# EAGLE design TouringMachineA2 (EAGLE 9.6.2)
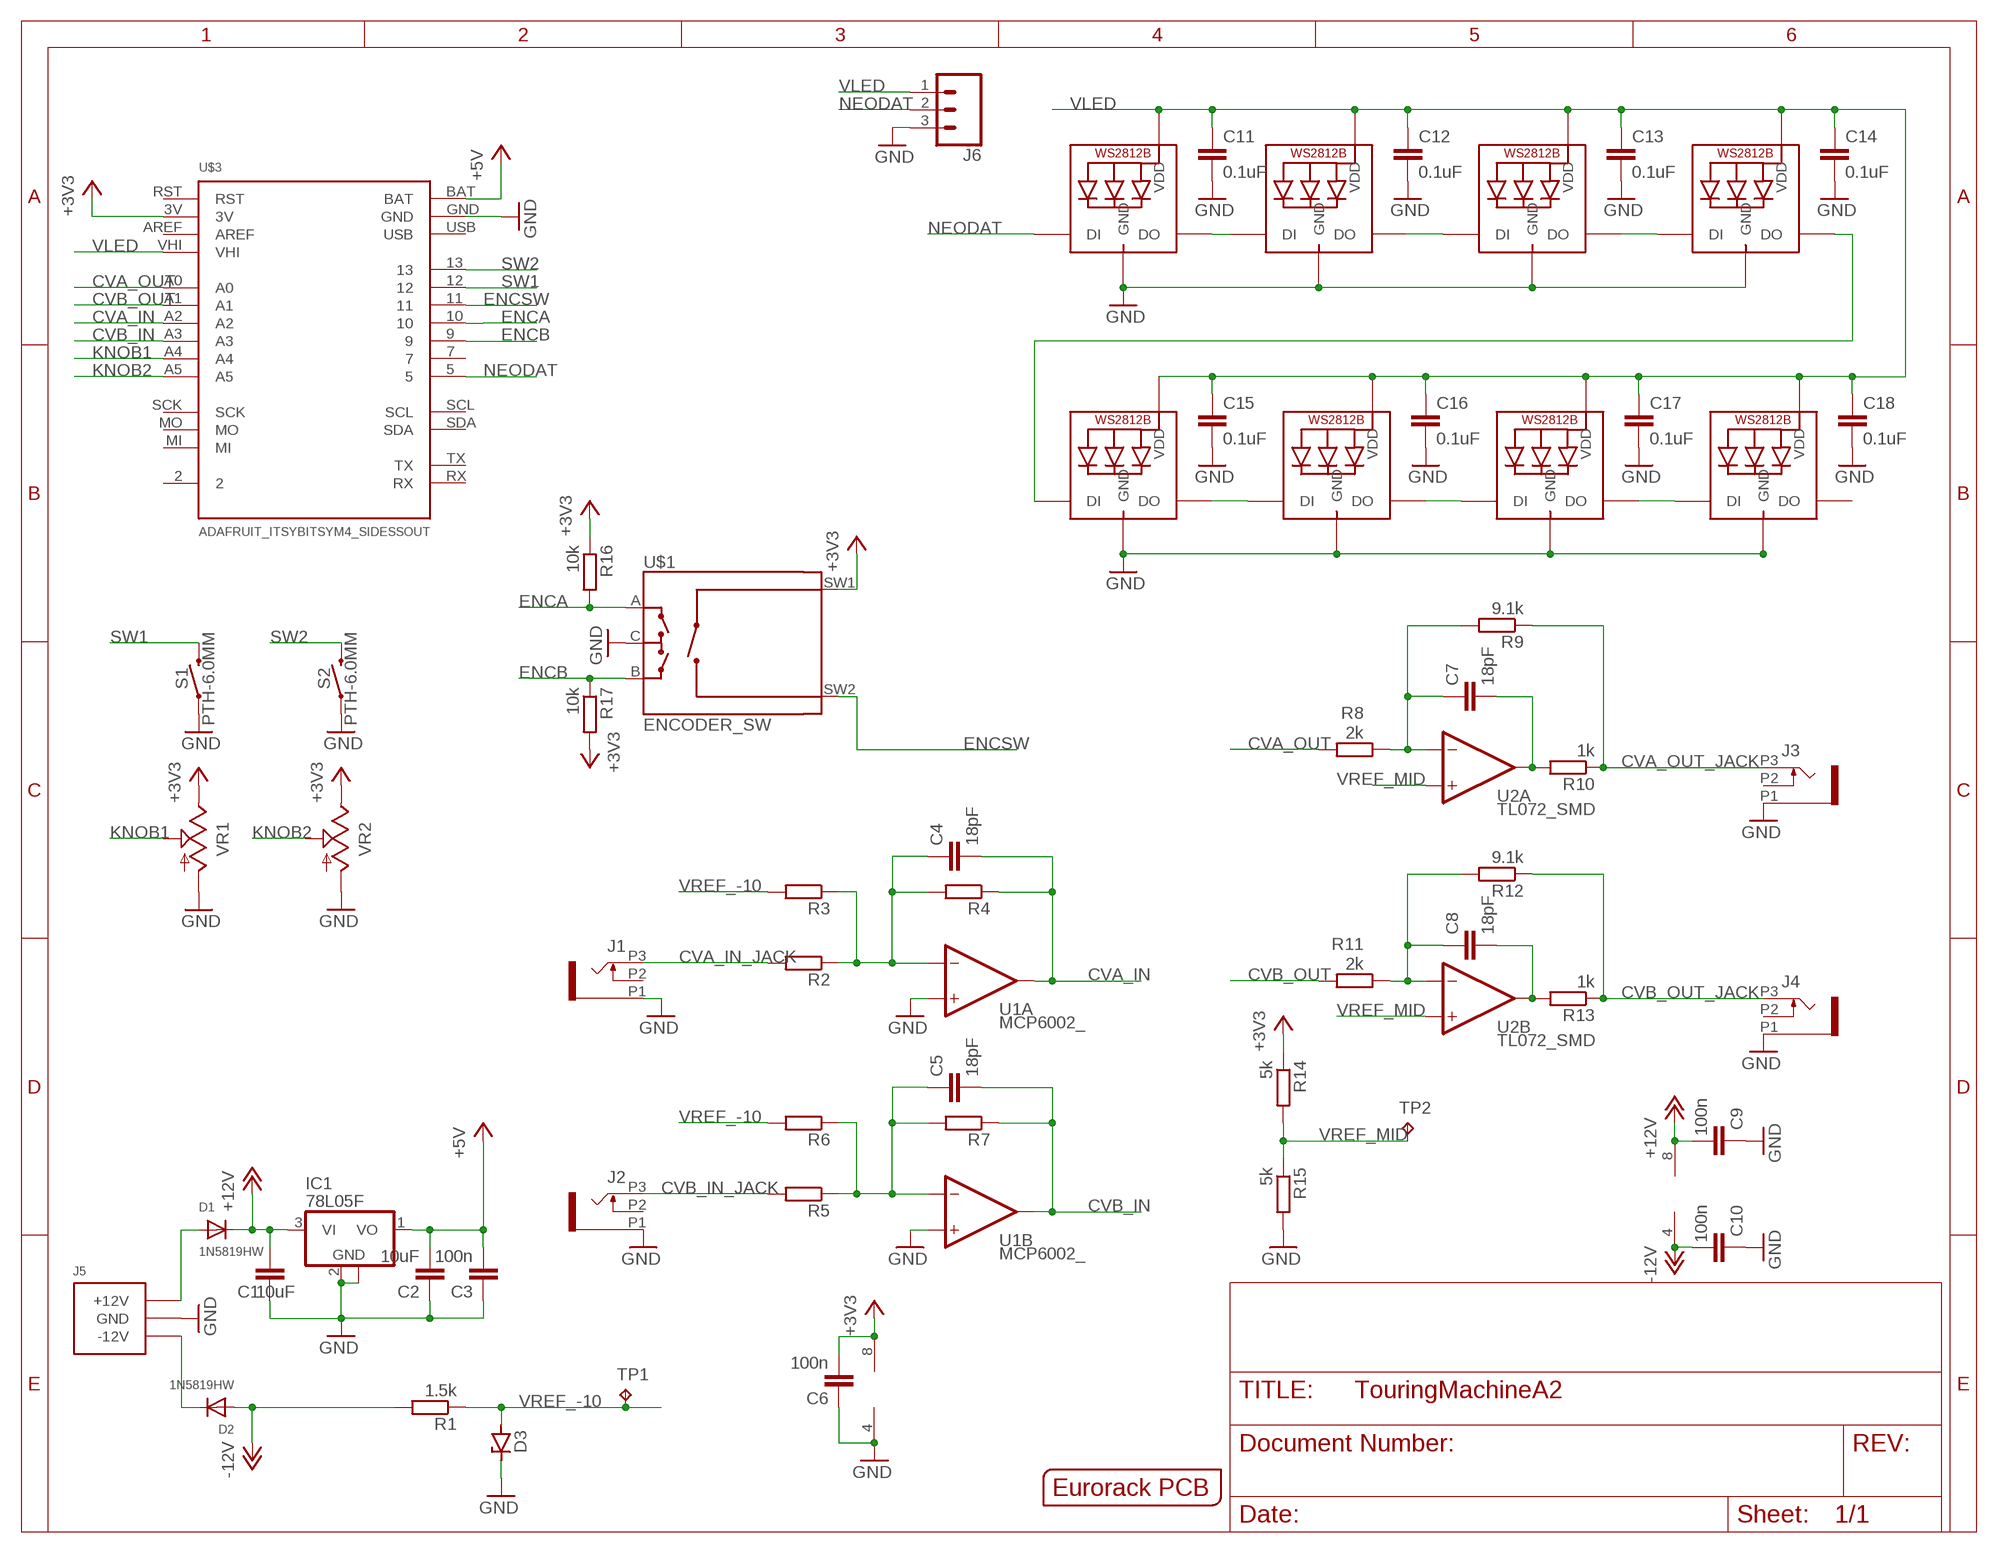
[diagram p0: schematic, sheet 1]

## Parts
C1  10uF  C-EUC0603  [C0603]
C2  10uF  C-EUC0603  [C0603]
C3  100n  C-EUC0603  [C0603]
C4  18pF  C-EUC0603  [C0603]
C5  18pF  C-EUC0603  [C0603]
C6  100n  C-EUC0603  [C0603]
C7  18pF  C-EUC0603  [C0603]
C8  18pF  C-EUC0603  [C0603]
C9  100n  C-EUC0603  [C0603]
C10  100n  C-EUC0603  [C0603]
C11  0.1uF  C-EUC0603  [C0603]
C12  0.1uF  C-EUC0603  [C0603]
C13  0.1uF  C-EUC0603  [C0603]
C14  0.1uF  C-EUC0603  [C0603]
C15  0.1uF  C-EUC0603  [C0603]
C16  0.1uF  C-EUC0603  [C0603]
C17  0.1uF  C-EUC0603  [C0603]
C18  0.1uF  C-EUC0603  [C0603]
D1  1N5819HW  DIODESOD-123  [SOD-123]
D2  1N5819HW  DIODESOD-123  [SOD-123]
D3  ZENER-DIODESOT23  [SOT23]
IC1  78L05F  [SOT89]
J1  PJ301_THONKICONN6  [WQP_PJ_301M6]
J2  PJ301_THONKICONN6  [WQP_PJ_301M6]
J3  PJ301_THONKICONN6  [WQP_PJ_301M6]
J4  PJ301_THONKICONN6  [WQP_PJ_301M6]
J5  POWER_SIMPLE10-OTHERSIDE  [POWER_10_LABELSOTHERSIDE]
J6  CONN_03  [1X03]
LED1  WS2812B5050  [WS2812B]
LED2  WS2812B5050  [WS2812B]
LED3  WS2812B5050  [WS2812B]
LED4  WS2812B5050  [WS2812B]
LED5  WS2812B5050  [WS2812B]
LED6  WS2812B5050  [WS2812B]
LED7  WS2812B5050  [WS2812B]
LED8  WS2812B5050  [WS2812B]
PCB1  EURORACK_PCB6HP  [EURORACK6HPPCB]
R1  1.5k  R-EU_R0603  [R0603]
R2  R-EU_R0603  [R0603]
R3  R-EU_R0603  [R0603]
R4  R-EU_R0603  [R0603]
R5  R-EU_R0603  [R0603]
R6  R-EU_R0603  [R0603]
R7  R-EU_R0603  [R0603]
R8  2k  R-EU_R0603  [R0603]
R9  9.1k  R-EU_R0603  [R0603]
R10  1k  R-EU_R0603  [R0603]
R11  2k  R-EU_R0603  [R0603]
R12  9.1k  R-EU_R0603  [R0603]
R13  1k  R-EU_R0603  [R0603]
R14  5k  R-EU_R0603  [R0603]
R15  5k  R-EU_R0603  [R0603]
R16  10k  R-EU_R0603  [R0603]
R17  10k  R-EU_R0603  [R0603]
S1  PTH-6.0MM  MOMENTARY-SWITCH-SPST-PTH-6.0MM  [TACTILE_SWITCH_PTH_6.0MM]
S2  PTH-6.0MM  MOMENTARY-SWITCH-SPST-PTH-6.0MM  [TACTILE_SWITCH_PTH_6.0MM]
TP1  TPTP15R  [TP15R]
TP2  TPTP15R  [TP15R]
U1  MCP6002_  [SO08]
U2  TL072_SMD  [SO08]
U$1  ENCODER_SW  [ENCODER_SW]
U$3  ADAFRUIT_ITSYBITSYM4_SIDESSOUT  [ADAFRUIT_ITSYBITSYM4_SIDESOUT]
VR1  9MM_SNAP-IN_POT_  [9MM_SNAP-IN_POT]
VR2  9MM_SNAP-IN_POT_  [9MM_SNAP-IN_POT]

## Nets
+3V3: C6.2 R14.1 R16.1 R17.2 U1.8(P:V+) U$1.SW1 U$3.3V VR1.3(E) VR2.3(E)
+5V: C2.2 C3.2 IC1.1(VO) U$3.BAT
+12V: C1.2 C9.2 D1.C IC1.3(VI) U2.8(P:V+)
-12V: C10.2 D2.A R1.2 U2.4(P:V-)
CVA_IN: C4.2 R4.1 U1.1(A:OUT) U$3.A2
CVA_IN_JACK: J1.P3 R2.2
CVA_OUT: R8.2 U$3.A0
CVA_OUT_JACK: J3.P3 R9.1 R10.1
CVB_IN: C5.2 R7.1 U1.7(B:OUT) U$3.A3
CVB_IN_JACK: J2.P3 R5.2
CVB_OUT: R11.2 U$3.A1
CVB_OUT_JACK: J4.P3 R12.1 R13.1
ENCA: R16.2 U$1.A U$3.10
ENCB: R17.1 U$1.B U$3.9
ENCSW: U$1.SW2 U$3.11
GND: C1.1 C2.1 C3.1 C6.1 C9.1 C10.1 C11.2 C12.2 C13.2 C14.2 C15.2 C16.2 C17.2 C18.2 D3.3(C) IC1.2(GND) IC1.2@1(GND) J1.P1 J2.P1 J3.P1 J4.P1 J5.3(GND) J5.4(GND) J5.5(GND) J5.6(GND) J5.7(GND) J5.8(GND) J6.3 LED1.3-GND(GND) LED2.3-GND(GND) LED3.3-GND(GND) LED4.3-GND(GND) LED5.3-GND(GND) LED6.3-GND(GND) LED7.3-GND(GND) LED8.3-GND(GND) R15.2 S1.1 S2.1 U1.3(A:+IN) U1.4(P:V-) U1.5(B:+IN) U$1.C U$3.GND VR1.1(A) VR2.1(A)
KNOB1: U$3.A4 VR1.2(S)
KNOB2: U$3.A5 VR2.2(S)
N$1: LED2.2-DOUT(DO) LED3.4-DIN(DI)
N$2: LED1.2-DOUT(DO) LED2.4-DIN(DI)
N$3: LED3.2-DOUT(DO) LED4.4-DIN(DI)
N$4: LED5.2-DOUT(DO) LED6.4-DIN(DI)
N$5: LED6.2-DOUT(DO) LED7.4-DIN(DI)
N$6: LED7.2-DOUT(DO) LED8.4-DIN(DI)
N$7: LED4.2-DOUT(DO) LED5.4-DIN(DI)
N$8: D1.A J5.9(+12V) J5.10(+12V)
N$9: D2.C J5.1(-12V) J5.2(-12V)
N$10: C4.1 R2.1 R3.1 R4.2 U1.2(A:-IN)
N$11: C7.1 R8.1 R9.2 U2.2(A:-IN)
N$13: C7.2 R10.2 U2.1(A:OUT)
N$14: C8.1 R11.1 R12.2 U2.6(B:-IN)
N$15: C5.1 R5.1 R6.1 R7.2 U1.6(B:-IN)
N$20: C8.2 R13.2 U2.7(B:OUT)
NEODAT: J6.2 LED1.4-DIN(DI) U$3.5
SW1: S1.3 U$3.12
SW2: S2.3 U$3.13
VLED: C11.1 C12.1 C13.1 C14.1 C15.1 C16.1 C17.1 C18.1 J6.1 LED1.1-VDD(VDD) LED2.1-VDD(VDD) LED3.1-VDD(VDD) LED4.1-VDD(VDD) LED5.1-VDD(VDD) LED6.1-VDD(VDD) LED7.1-VDD(VDD) LED8.1-VDD(VDD) U$3.VHI
VREF_-10: D3.1(A) R1.1 R3.2 R6.2 TP1.TP
VREF_MID: R14.2 R15.1 TP2.TP U2.3(A:+IN) U2.5(B:+IN)
Unconnected: J1.P2 J2.P2 J3.P2 J4.P2 LED8.2-DOUT(DO) U$3.2 U$3.7 U$3.AREF U$3.MI U$3.MO U$3.RST U$3.RX U$3.SCK U$3.SCL U$3.SDA U$3.TX U$3.USB

## Library data of the parts
C1-C18 = resistor:C-EU: CAPACITOR, European symbol
D1 D2 = adafruit:DIODE: Diode SMADIODE - SMA Surface Mount Package 20V 1A Schottky Diode Digikey: 641-1014-6-ND DO-1N4148 - Through Hole Small Current Diode SOD-123 20V 1 A (.5mV Vf) Schottky Diode - Digikey: MBRX120TPMSCT-ND SOD-323 10V 570mA (.38mV Vf, 3ns) Schottky Diode - Digikey: ZLLS410CT-ND SOD-523 30V 30mA Schottky Diode (RB751S-40TE61) - Digikey: RB751S-40TE61CT-ND SOT23-R/W - SOT23 Package (R = Solder Paste/Reflow Ovens, W = Hand-Soldering) BAT54Film 40V 300mA - Digikey: 497-7162-1-ND
D3 = diode:ZENER-DIODE: Z-Diode
IC1 = linear:78L*: POSITOIV-VOLTAGE REGULATORS Output up to 100 mA Source: Datasheet <http://focus.ti.com/lit/ds/symlink/ua78l05.pdf>
J1-J4 = og-pj301_variations:PJ301_THONKICONN
J5 = EurorackModularParts:POWER_SIMPLE
J6 = SparkFun-Connectors:CONN_03: Multi connection point. Often used as Generic Header-pin footprint for 0.1 inch spaced/style header connections On any of the 0.1 inch spaced packages, you can populate with these: Break Away Headers - Straight <https://www.sparkfun.com/products/116> (PRT-00116) Break Away Male Headers - Right Angle <https://www.sparkfun.com/products/553> (PRT-00553) Female Headers <https://www.sparkfun.com/products/115> (PRT-00115) Break Away Headers - Machine Pin <https://www.sparkfun.com/products/117> (PRT-00117) Break Away Female Headers - Swiss Machine Pin <https://www.sparkfun.com/products/743> (PRT-00743) Stackable Header - 3 Pin (Female, 0.1") <https://www.sparkfun.com/products/13875> (PRT-13875) For SCREWTERMINALS and SPRING TERMINALS visit here: Screw Terimnals on SparkFun.com <https://www.sparkfun.com/search/results?term=Screw+Terminals> (5mm/3.5mm/2.54mm spacing) This device is also useful as a general connection point to wire up your design to another part of your project. Our various solder wires solder well into these plated through hole pads. Hook-Up Wire - Assortment (Stranded, 22 AWG) <https://www.sparkfun.com/products/11375> (PRT-11375) Hook-Up Wire - Assortment (Solid Core, 22 AWG) <https://www.sparkfun.com/products/11367> (PRT-11367) View the entire wire category on our website here <https://www.sparkfun.com/categories/141> Special notes: Molex polarized connector foot print use with SKU : PRT-08232 with associated crimp pins and housings.
LED1-LED8 = adafruit:WS2812B
PCB1 = EurorackModularParts:EURORACK_PCB
R1-R17 = resistor:R-EU_: RESISTOR, European symbol
S1 S2 = SparkFun-Switches:MOMENTARY-SWITCH-SPST: Momentary Switch (Pushbutton) - SPST Normally-open (NO) SPST momentary switches (buttons, pushbuttons). Variants PTH-12MM - 12mm square, through-hole Momentary Pushbutton Switch - 12mm Square <https://www.sparkfun.com/products/9190> (COM-09190) PTH-6.0MM, PTH-6.0MM-KIT - 6.0mm square, through-hole Mini Pushbutton Switch <https://www.sparkfun.com/products/97> (COM-00097) KIT package intended for soldering kit's - only one side of pads' copper is exposed. PTH-RIGHT-ANGLE-KIT - Right-angle, through-hole Right Angle Tactile Button <https://www.sparkfun.com/products/10791> - Used on SparkFun BigTime Watch Kit <https://www.sparkfun.com/products/11734> SMD-12MM - 12mm square, surface-mount Tactile Button - SMD (12mm) <https://www.sparkfun.com/products/12993> (COM-12993) Used on SparkFun PicoBoard <https://www.sparkfun.com/products/11888> SMD-4.5MM - 4.5mm Square Trackball Switch Used on SparkFun Blackberry Trackballer Breakout <https://www.sparkfun.com/products/13169> SMD-4.6MMX2.8MM - 4.60mm x 2.80mm, surface mount Used on SparkFun SAMD21 Mini Breakout <https://www.sparkfun.com/products/13664> SMD-5.2MM, SMD-5.2-REDUNDANT - 5.2mm square, surface-mount Mini Pushbutton Switch - SMD <https://www.sparkfun.com/products/8720> (COM-08720) Used on Arduino Pro Mini <https://www.sparkfun.com/products/11114> REDUNDANT package connects both switch circuits together SMD-6.0X3.5MM - 6.0 x 3.5mm, surface mount Momentary Reset Switch SMD <https://www.sparkfun.com/products/8229> (COM-08229) SMD-6.2MM-TALL - 6.2mm square, surface mount Tactile Button - SMD (6mm) <https://www.sparkfun.com/products/12992> Used on SparkFun Digital Sandbox <https://www.sparkfun.com/products/12651> SMD-RIGHT-ANGLE - Right-angle, surface mount Used on SparkFun Block for Intel® Edison - Arduino <https://www.sparkfun.com/products/13036>; PROD_ID: SWCH-08441; SF_SKU: COM-00097
TP1 TP2 = testpad:TP: Test pad
U1 = MusicThingModular:MCP6002: Generic Dual Op Amp
U2 = MusicThingModular:TL072: Generic Dual Op Amp
U$1 = halcyonmod_Switches:ENCODER_SW: Encoder, with Switch
U$3 = todstuff:ADAFRUIT_ITSYBITSYM4_SIDES
VR1 VR2 = MusicThingModular:9MM_SNAP-IN_POT: 9mm vertical snap-in pot, Alpha / Panasonic style

## Board
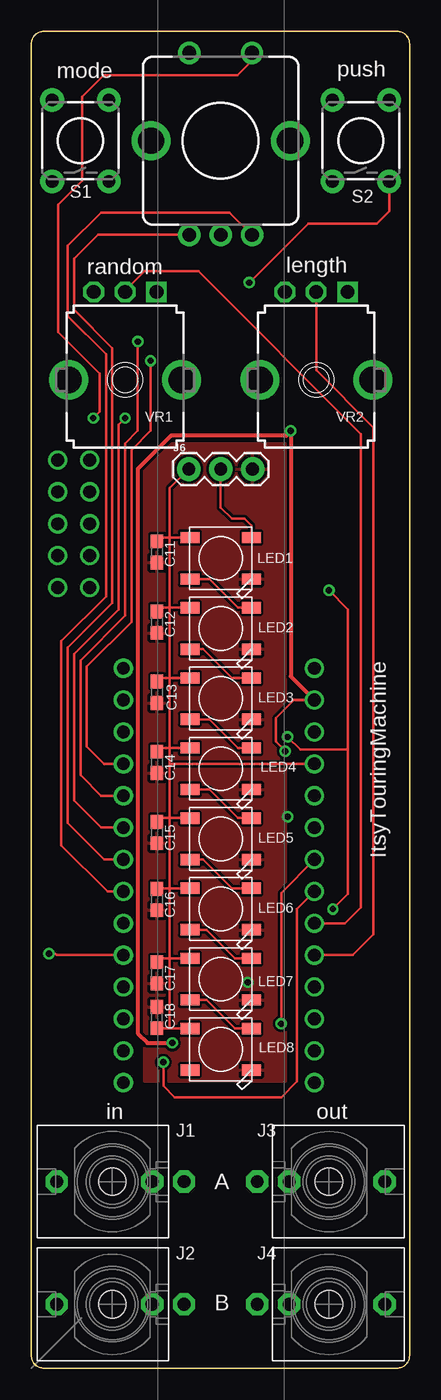
[diagram p1: board, top side]
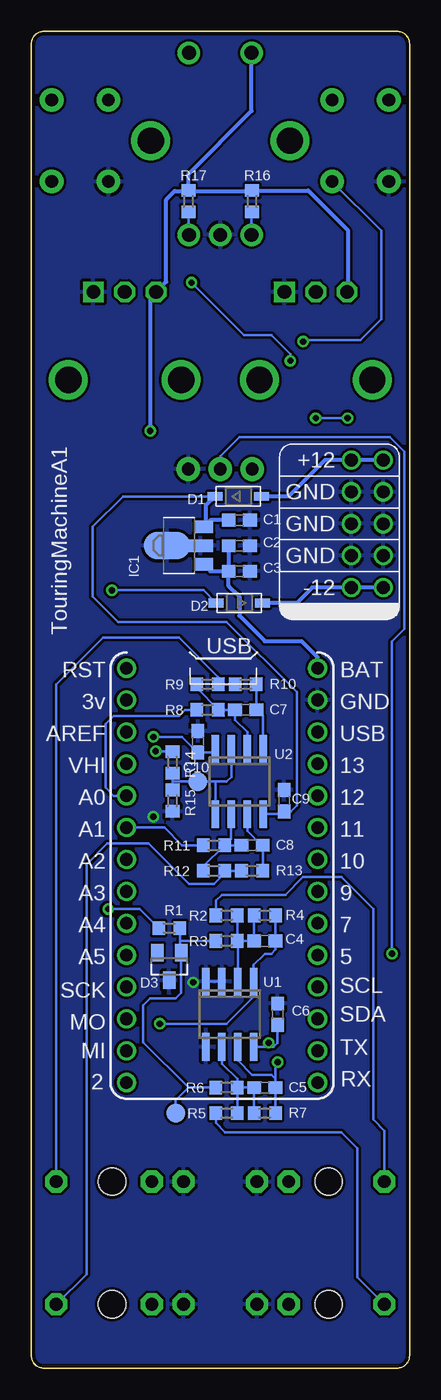
[diagram p2: board, bottom side, seen from below]

Size 30.16 x 106.5 mm. Coordinates in mm from the lower left corner, seen from the top.
Copper layers (1*16): Top 0.035mm / dielectric 1.5mm / Bottom 0.035mm
Design rules "adafruit-rules-20180530": minimum track width 8mil, minimum drill 16mil, track to track 8mil, track to pad 8mil, pad to pad 8mil, via to via 8mil, smd to smd 8mil, copper to edge 10mil, drill to drill 8mil, minimum pad ring 10mil, minimum via ring 8mil, stop-mask expansion 4mil, vias tented up to drill 20mil, thermal gap 10mil

### Footprints (pad centres in the part's own frame; a part is rotated, then mirrored left to right if it is on the bottom)
C0603 = smd 1.1 x 1: 1 -0.85,0; 2 0.85,0
SOD-123 = smd 1.2 x 0.7: A 1.85,0; C -1.85,0
SOT23 = smd 1 x 1.4: 1 -0.95,-1.1; 2 0.95,-1.1; 3 0,1.1
SOT89 = smd 1 x 1.5: 1 -1.499,-1.981; 3 1.499,-1.981 | smd 1 x 2: 2 0,-1.727 | smd 2.2 x 3.7: 2@1 0,0.94
WQP_PJ_301M6 = drill 1.016 pad 1.778 octagon: P1 0,-5.715; P2 0,-3.175; P3 0,4.445 | hole 2.2: 0,0
POWER_10_LABELSOTHERSIDE = drill 1.016: 1 -5.08,-1.27; 2 -5.08,1.27; 3 -2.54,-1.27; 4 -2.54,1.27; 5 0,-1.27; 6 0,1.27; 7 2.54,-1.27; 8 2.54,1.27; 9 5.08,-1.27; 10 5.08,1.27
1X03 = drill 1.016 pad 1.88: 1 0,0; 2 2.54,0; 3 5.08,0
WS2812B = smd 1.5 x 0.9: 1-VDD 2.45,-1.65; 2-DOUT 2.45,1.65; 3-GND -2.45,1.65; 4-DIN -2.45,-1.65
R0603 = smd 1 x 1.1: 1 -0.85,0; 2 0.85,0
TACTILE_SWITCH_PTH_6.0MM = drill 1.016 pad 1.88: 1 -3.251,2.261; 2 3.251,2.261; 3 -3.251,-2.261; 4 3.251,-2.261
TP15R = smd 1.5 x 1.5: TP 0,0
SO08 = smd 0.6 x 2.2: 1 -1.905,-2.6; 2 -0.635,-2.6; 3 0.635,-2.6; 4 1.905,-2.6; 5 1.905,2.6; 6 0.635,2.6; 7 -0.635,2.6; 8 -1.905,2.6
ENCODER_SW = drill 1.1 pad 1.8: A -2.5,-7.5; B 2.5,-7.5; C 0,-7.5 | drill 2.1: M1 -5.55,0; M2 5.55,0 | drill 1.1 pad 1.778: SW1 -2.5,7; SW2 2.5,7
ADAFRUIT_ITSYBITSYM4_SIDESOUT = drill 1.016: 2 15.24,-7.62; 3V -15.24,-7.62; 5 5.08,7.62; 7 2.54,7.62; 9 0,7.62; 10 -2.54,7.62; 11 -5.08,7.62; 12 -7.62,7.62; 13 -10.16,7.62; A0 -7.62,-7.62; A1 -5.08,-7.62; A2 -2.54,-7.62; A3 0,-7.62; A4 2.54,-7.62; A5 5.08,-7.62; AREF -12.7,-7.62; BAT -17.78,7.62; GND -15.24,7.62; MI 12.7,-7.62; MO 10.16,-7.62; RST -17.78,-7.62; RX 15.24,7.62; SCK 7.62,-7.62; SCL 7.62,7.62; SDA 10.16,7.62; TX 12.7,7.62; USB -12.7,7.62; VHI -10.16,-7.62
9MM_SNAP-IN_POT = drill 1.1 square: 1 -2.5,-7 | drill 1.1 octagon: 2 0,-7; 3 2.5,-7 | drill 2.1 pad 2.794: CHASSIS1 -4.5,0; CHASSIS2 4.5,0

### Placement (x,y rotation side)
C1  13.57,67.56 180 bottom
C2  13.57,65.53 180 bottom
C3  13.57,63.5 180 bottom
C4  11.54,34.04 0 bottom
C5  11.54,22.35 0 bottom
C6  10.52,28.19 270 bottom
C7  13.06,52.45 0 bottom
C8  12.55,41.66 0 bottom
C9  10.01,45.21 270 bottom
C10  16.87,49.91 270 bottom
C11  10.01,65.02 270 top
C12  10.01,59.44 270 top
C13  10.01,53.85 270 top
C14  10.01,48.26 270 top
C15  10.01,42.67 270 top
C16  10.01,37.34 270 top
C17  10.01,31.5 270 top
C18  10.01,27.94 90 top
D1  13.65,69.45 0 bottom
D2  13.57,60.96 180 bottom
D3  19.16,32 180 bottom
IC1  18.4,65.53 90 bottom
J1  6.46,14.86 90 top
J2  6.46,5.08 90 top
J3  23.73,14.86 270 top
J4  23.73,5.08 270 top
J5  3.37,67.27 90 bottom
J6  12.55,71.63 0 top
LED1  15.09,64.52 180 top
LED2  15.09,58.93 180 top
LED3  15.09,53.34 180 top
LED4  15.09,47.75 180 top
LED5  15.09,42.16 180 top
LED6  15.09,36.58 180 top
LED7  15.09,30.99 180 top
LED8  15.09,25.4 180 top
PCB1  0.01,0 0 top
R1  19.16,35.05 180 bottom
R2  14.59,36.07 180 bottom
R3  14.59,34.04 180 bottom
R4  11.54,36.07 180 bottom
R5  14.59,20.32 180 bottom
R6  14.59,22.35 180 bottom
R7  11.54,20.32 180 bottom
R8  16.11,52.45 180 bottom
R9  16.11,54.48 180 bottom
R10  13.06,54.48 0 bottom
R11  15.6,41.66 180 bottom
R12  15.6,39.62 180 bottom
R13  12.55,39.62 0 bottom
R14  18.9,48.26 270 bottom
R15  18.9,45.21 270 bottom
R16  12.55,92.96 270 bottom
R17  17.63,92.96 90 bottom
S1  3.92,97.79 90 top
S2  26.27,97.79 90 top
TP1  18.65,20.32 0 bottom
TP2  16.87,46.74 0 bottom
U1  14.33,28.19 180 bottom
U2  13.57,46.74 180 bottom
U$1  15.09,97.79 0 top
U$3  14.95,37.98 270 bottom
VR1  7.47,78.74 180 top
VR2  22.71,78.74 180 top

### Tracks (layer width: path | path; a pad name or v marks a point on that pad's centre or on a via)
+3V3  (via drill 0.5)
  Top 0.203: v20.25,49.15 19.48,49.91 19.48,51.78 20.92,53.22 U$3.3V
  Top 0.305: U$3.3V 20.68,55.12 v20.68,74.68 20.3,74.3 11.16,74.3 8.49,71.63 8.49,26.67 9.25,25.91 v11.23,25.91
  Bottom 0.203: C6.2 10.52,25.91 10.84,25.59 10.91,25.59 | 10.91,25.59 U1.8 | R14.1 20.21,49.11 v20.25,49.15 | v11.23,25.91 10.91,25.59
  Bottom 0.305: 17.6,93.78 R17.2 17.63,95.12 12.59,100.16 U$1.SW1 | 17.6,93.78 12.59,93.78 R16.1 8.07,93.81 4.93,90.68 4.93,85.78 VR1.3 | v20.68,74.68 20.68,85.27 VR2.3 19.41,86.54 19.41,93.09 18.73,93.78 17.6,93.78
+5V
  Bottom 0.305: U$3.BAT 7.33,56.64 8.6,57.91 11.54,57.91 13.57,59.94 13.57,61.47 14.42,62.32 C3.2 | C2.2 C3.2 | IC1.1 15.88,63.5 C3.2
+12V
  Bottom 0.203: D1.C 22.86,69.45 25.25,67.06 25.25,61.47 23.22,59.44 14.59,59.44 9,53.85 9,44.83 9.47,44.36 C9.2 10.03,44.34 10.24,44.14 U2.8
  Bottom 0.305: C1.2 15.88,67.56 16.25,67.2 | 16.25,67.2 IC1.3 | D1.C 16.25,68.7 16.25,67.2
-12V  (via drill 0.5)
  Top 0.203: v24.04,36.58 25.25,37.79 25.25,49.28 | v23.73,61.98 25.25,60.45 25.25,49.28 | v20.43,50.29 21.44,49.28 25.25,49.28
  Bottom 0.203: R1.2 21.53,36.58 v24.04,36.58 | v23.73,61.98 16.44,61.98 D2.A | U2.4 15.75,49.06 C10.2 16.91,49.06 18.14,50.29 v20.43,50.29
CVA_IN  (via drill 0.5)
  Top 0.203: U$3.A2 19.92,37.87 v19.92,27.43
  Bottom 0.203: R4.1 C4.2 10.69,33.36 11.03,33.02 11.54,33.02 12.43,32.13 U1.1 12.43,29.59 14.59,27.43 v19.92,27.43
CVA_IN_JACK
  Bottom 0.203: J1.P3 2.01,18.92 2.9,19.81 2.9,36.58 5.44,39.12 8.49,39.12 9.89,37.72 14.97,37.72 15.44,37.25 R2.2
CVA_OUT
  Bottom 0.203: U$3.A0 23.59,45.6 24.24,46.25 24.24,51.31 23.59,51.95 18.38,51.95 17.89,52.45 R8.2
CVA_OUT_JACK
  Bottom 0.203: R10.1 R9.1 15.26,55.08 18.39,58.21 24.45,58.21 28.18,54.48 J3.P3
CVB_IN  (via drill 0.5)
  Top 0.203: U$3.A3 21.19,36.6 21.19,22.86 19.92,21.59 11.41,21.59 10.52,22.48 v10.52,24.38
  Bottom 0.203: C5.2 R7.1 | U1.7 13.7,24.51 12.55,23.37 11.03,23.37 10.69,23.03 C5.2 | v10.52,24.38 10.69,24.22 C5.2
CVB_IN_JACK
  Bottom 0.203: J2.P3 4.17,7.24 4.17,17.53 5.44,18.8 14.7,18.8 15.44,19.54 R5.2
CVB_OUT
  Bottom 0.203: U$3.A1 19.55,43.06 18.14,41.66 R11.2
CVB_OUT_JACK
  Bottom 0.203: R13.1 R12.1 14.75,39.41 15.59,38.57 17.59,38.57 20.81,41.78 24.11,41.78 25.76,40.13 25.76,7.49 J4.P3
ENCA
  Top 0.203: U$3.10 5.81,40.52 2.9,43.43 2.9,57.4 6.46,60.96 6.46,81.28 3.41,84.33 3.41,88.39 5.31,90.29 U$1.A
  Bottom 0.203: R16.2 12.59,92.07 U$1.A
ENCB
  Top 0.203: U$1.B 15.81,92.08 5.57,92.08 2.9,89.41 2.9,83.83 5.95,80.78 5.95,61.47 2.39,57.91 2.39,41.66 6.07,37.98 U$3.9
  Bottom 0.203: R17.1 17.63,90.33 U$1.B
ENCSW  (via drill 0.5)
  Top 0.203: v7.47,75.69 6.97,75.18 6.97,60.45 3.41,56.9 3.41,45.21 5.56,43.06 U$3.11 | U$1.SW2 17.59,104.16 16.45,103.01 5.77,103.01 4.04,101.28 4.04,94.61 2.14,92.71 2.14,82.55 5.44,79.25 5.44,76.2 v4.93,75.69
  Bottom 0.203: v4.93,75.69 v7.47,75.69
GND  (via drill 0.5)
  Bottom 0.203: U1.4 U1.3
  other vias: 20.43,43.94 17.25,30.73
  pour Bottom: -0.91,108.07 -0.91,-0.76 31.35,-0.76 30.84,108.2
  pour Top: 9,73.66 20.3,73.66 20.3,22.86 9,22.86
KNOB1
  Top 0.203: 7.47,85.83 9.02,87.38 13.31,87.38 26.27,74.42 26.27,36.72 24.99,35.44 U$3.A4
  Top 0.305: VR1.2 7.47,85.83
KNOB2
  Top 0.203: VR2.2 22.71,79.5 27.29,74.93 27.29,34.54 25.65,32.9 U$3.A5
N$1
  Top 0.203: LED2.2-DOUT 13.7,57.28 15.98,54.99 LED3.4-DIN
N$2
  Top 0.203: LED1.2-DOUT 14.2,62.87 16.49,60.58 LED2.4-DIN
N$3
  Top 0.203: LED3.2-DOUT 14.2,51.69 16.49,49.4 LED4.4-DIN
N$4
  Top 0.203: LED5.2-DOUT 13.7,40.51 15.98,38.23 LED6.4-DIN
N$5
  Top 0.203: LED6.2-DOUT 13.95,34.93 16.24,32.64 LED7.4-DIN
N$6
  Top 0.203: LED7.2-DOUT 13.95,29.34 16.24,27.05 LED8.4-DIN
N$7
  Top 0.203: LED4.2-DOUT 14.2,46.1 16.49,43.81 LED5.4-DIN
N$8
  Bottom 0.305: J5.9 J5.10 6.75,72.35 9.65,69.45 D1.A
N$9
  Bottom 0.305: J5.1 J5.2 7.77,62.19 9,60.96 D2.C
N$10
  Bottom 0.203: R4.2 C4.1 R3.1 | R3.1 R2.1 | R3.1 13.7,34 U1.2
N$11
  Bottom 0.203: R8.1 15.22,52.45 | 15.22,52.45 C7.1 13.91,51.65 12.93,50.67 U2.2 | R9.2 16.96,54.19 15.22,52.45
N$13
  Bottom 0.203: R10.2 C7.2 11.7,51.94 11.7,49.38 U2.1
N$14
  Bottom 0.203: U2.6 14.24,44.1 14.24,42.16 R11.1 | R11.1 16.45,39.96 R12.2 | R11.1 C8.1
N$15
  Bottom 0.203: R7.2 C5.1 R6.1 | R6.1 R5.1 | U1.6 14.97,24.26 13.74,23.03 R6.1
N$20
  Bottom 0.203: R13.2 C8.2 11.79,41.66 12.93,42.8 U2.7
NEODAT  (via drill 0.5)
  Top 0.203: J6.2 15.09,68.58 15.98,67.69 17,67.69 17.54,67.15 LED1.4-DIN | U$3.5 2,32.9 1.89,33.02 v1.41,33.02
  Bottom 0.203: v1.41,33.02 1.41,57.9 0.42,58.88 0.42,73.03 1.56,74.17 13.57,74.17 15.09,72.64 J6.2
SW1  (via drill 0.5)
  Top 0.203: v8.49,81.79 8.49,74.68 7.47,73.66 7.47,59.94 3.92,56.39 3.92,47.24 5.56,45.6 U$3.12
  Bottom 0.203: v8.49,81.79 8.36,81.92 3.92,81.92 2.27,83.57 2.27,90.63 S1.3
SW2  (via drill 0.5)
  Top 0.203: v9.51,80.26 9.51,74.68 7.98,73.15 7.98,59.44 4.43,55.88 4.43,49.53 5.81,48.14 U$3.13 | v17.38,86.49 22.08,91.19 27.54,91.19 28.53,92.18 S2.3
  Bottom 0.203: v17.38,86.49 13.19,82.3 11.03,82.3 9.51,80.77 v9.51,80.26
VLED
  Top 0.203: J6.1 11.03,70.1 11.03,66.17 | 11.03,66.17 11.03,60.58 | 11.03,60.58 11.03,54.99 | 11.03,54.99 11.03,49.4 | 11.03,49.4 11.03,48.26 | 11.03,48.26 11.03,43.81 | 11.03,43.81 11.03,38.23 | 11.03,38.23 11.03,32.64 | LED1.1-VDD 11.03,66.17 | C11.1 10.31,66.17 11.03,66.17 | C17.1 10.31,32.64 11.03,32.64 | C15.1 10.01,43.81 11.03,43.81 | C14.1 10.01,49.4 11.03,49.4 | 11.03,54.99 10.01,54.99 C13.1 | C12.1 10.01,60.58 11.03,60.58 | U$3.VHI 11.15,48.14 11.03,48.26 | LED7.1-VDD 11.03,32.64 | LED2.1-VDD 11.03,60.58 | LED3.1-VDD 11.03,54.99 | LED4.1-VDD 11.03,49.4 | LED5.1-VDD 11.03,43.81 | C16.1 10.05,38.23 11.03,38.23 | LED6.1-VDD 11.03,38.23 | LED8.1-VDD 11.03,27.05 | 11.03,27.05 10.05,27.05 C18.1 | 11.03,32.64 11.03,27.05
VREF_-10
  Bottom 0.203: R1.1 18.31,34.04 | 18.31,34.04 18.31,33.2 D3.1 18.21,29.91 18.65,29.46 20.68,29.46 21.25,28.89 21.25,25.97 17.63,22.35 | R3.2 18.31,34.04 | 17.63,22.35 R6.2 | TP1.TP 18.65,21.34 17.63,22.35
VREF_MID
  Bottom 0.203: R15.1 18.9,46.74 | 18.9,46.74 R14.2 | U2.3 14.21,47.12 14.59,46.74 15.47,46.74 | U2.5 15.47,46.74 | 15.47,46.74 TP2.TP 18.9,46.74

### Text on the board
tPlace: mode | push | random | length | ItsyTouringMachine | in | out | A | B
bPlace: TouringMachineA1